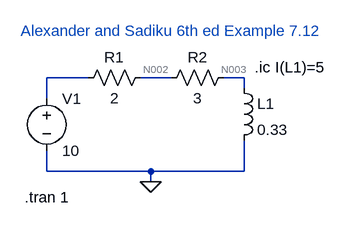
[diagram p0: schematic sadiku_chapter7_example_712_RL_Response.asc]
sadiku_chapter7_example_712_RL_Response.asc, the LTspice schematic file:
Version 4
SHEET 1 880 680
WIRE 112 96 48 96
WIRE 240 96 192 96
WIRE 352 96 320 96
WIRE 352 112 352 96
WIRE 48 128 48 96
WIRE 48 240 48 208
WIRE 208 240 48 240
WIRE 352 240 352 192
WIRE 352 240 208 240
WIRE 208 256 208 240
FLAG 208 256 0
SYMBOL voltage 48 112 R0
WINDOW 123 0 0 Left 0
WINDOW 39 0 0 Left 0
SYMATTR InstName V1
SYMATTR Value 10
SYMBOL res 208 80 R90
WINDOW 0 0 56 VBottom 2
WINDOW 3 32 56 VTop 2
SYMATTR InstName R1
SYMATTR Value 2
SYMBOL res 336 80 R90
WINDOW 0 0 56 VBottom 2
WINDOW 3 32 56 VTop 2
SYMATTR InstName R2
SYMATTR Value 3
SYMBOL ind 336 96 R0
SYMATTR InstName L1
SYMATTR Value 0.33
TEXT 368 80 Left 2 !.ic I(L1)=5
TEXT 14 280 Left 2 !.tran 1
TEXT 8 24 Left 2 ;Alexander and Sadiku 6th ed Example 7.12

The netlist it stands for:
* sadiku_chapter7_example_712_RL_Response.asc
V1 N001 0 10
R1 N002 N001 2
R2 N003 N002 3
L1 N003 0 0.33
.ic I(L1)=5
.tran 1
* Alexander and Sadiku 6th ed Example 7.12
.backanno
.end

* Results of the author's LTspice run, read from the files saved beside the schematic
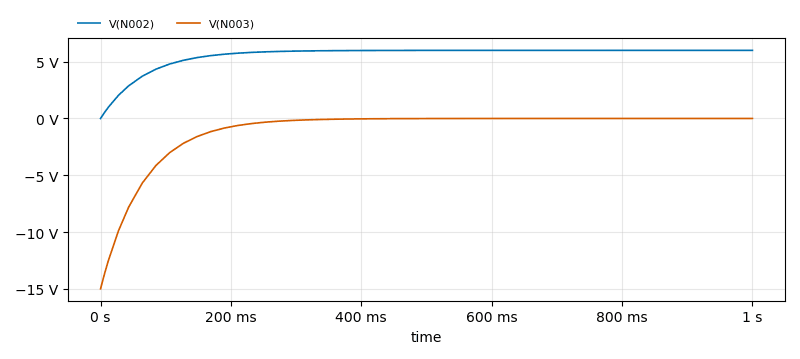
[diagram p1: Transient Analysis of sadiku_chapter7_example_712_RL_Response.asc, plotted from the saved traces]
* Transient Analysis, 1 run:
*   V(N002): min 0 V, max 6.001 V, average 5.602 V, rms 5.695 V, last 6.001 V
*   V(N003): min -15 V, max 1.996 mV, average -993.9 mV, rms 2.749 V, last 1.996 mV